# EAGLE design main_board (EAGLE 9.2.2)
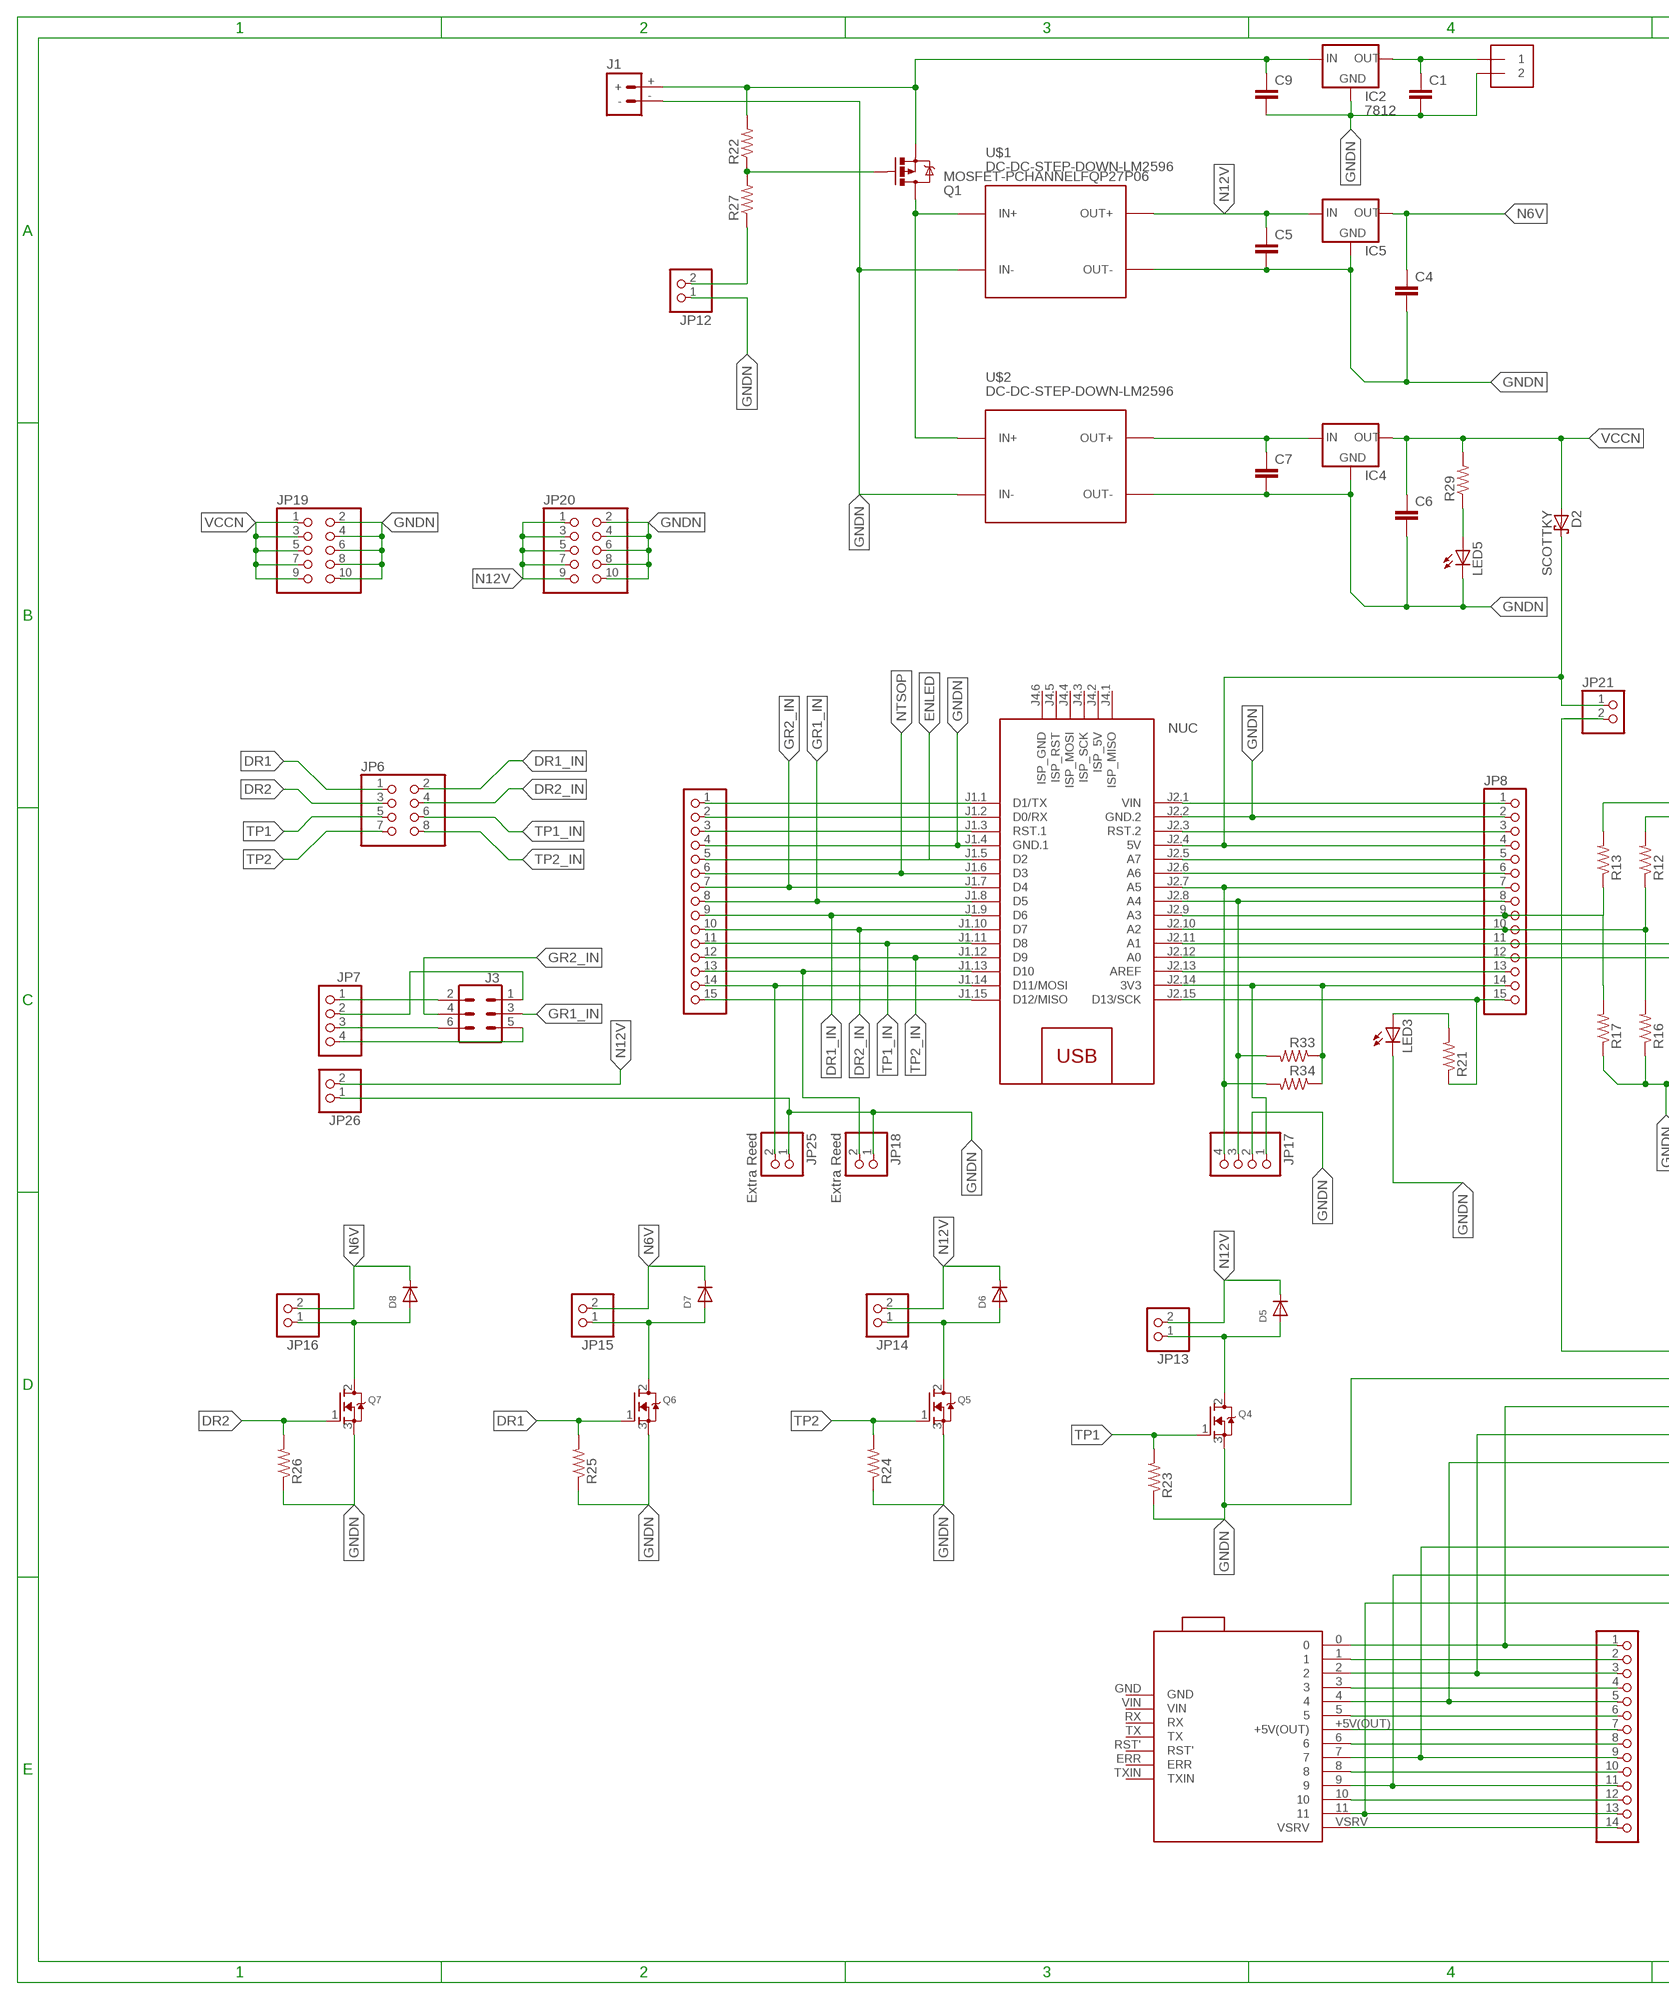
[diagram p0: schematic, sheet 1, part 1 of 2]
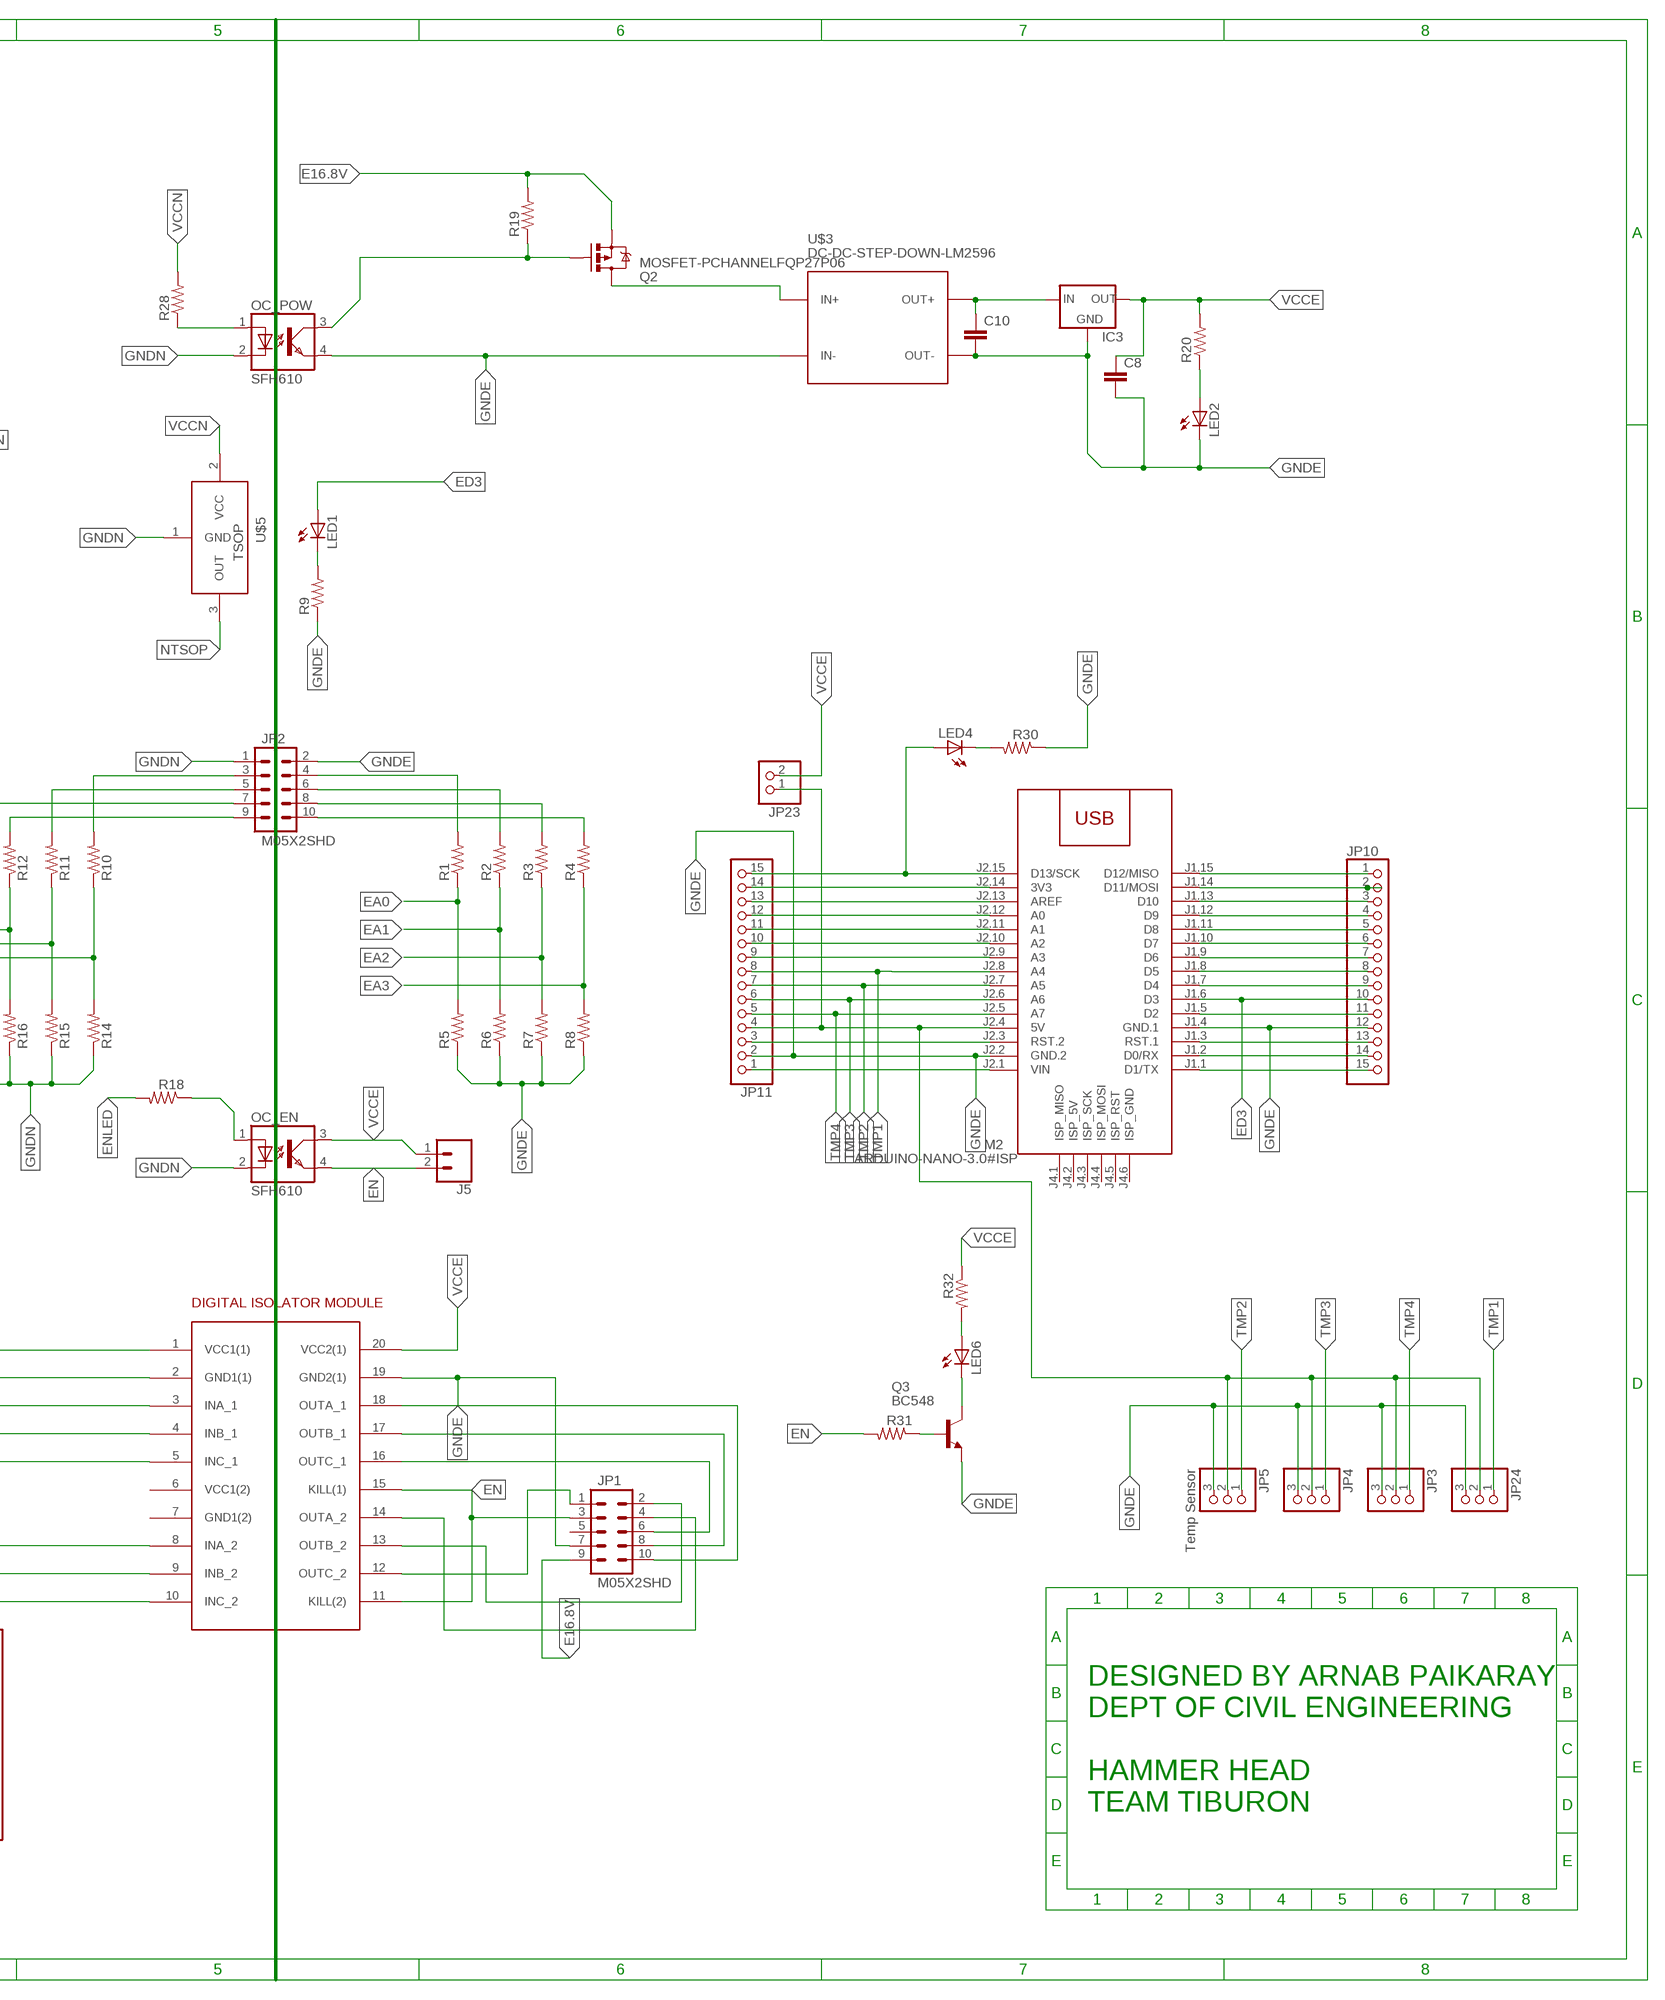
[diagram p1: schematic, sheet 1, part 2 of 2]

## Parts
C1  C-EU025-025X050  [C025-025X050]
C4  C-EU025-025X050  [C025-025X050]
C5  C-EU025-025X050  [C025-025X050]
C6  C-EU025-025X050  [C025-025X050]
C7  C-EU025-025X050  [C025-025X050]
C8  C-EU025-025X050  [C025-025X050]
C9  C-EU025-025X050  [C025-025X050]
C10  C-EU025-025X050  [C025-025X050]
D2  SCOTTKY  SCHOTTKY-DIODECB417-15  [CB417-15]
D5  DIODEDO-1N4148  [DO-1N4148]
D6  DIODEDO-1N4148  [DO-1N4148]
D7  DIODEDO-1N4148  [DO-1N4148]
D8  DIODEDO-1N4148  [DO-1N4148]
IC2  7812  78MXXS  [78MXXS]
IC3  78XXS  [78XXS]
IC4  78XXS  [78XXS]
IC5  78XXS  [78XXS]
J1  BATTERY_CONN_DEANS  [DEANS]
J3  CONN_03X2NO_SILK  [2X3-NS]
J5  CONN_02LOCK_LONGPADS  [1X02_LOCK_LONGPADS]
J6  1X2-3.5MM  [1X2-3.5MM]
JP1  M05X2SHD  [2X5-SHROUDED]
JP2  M05X2SHD  [2X5-SHROUDED]
JP3  PINHD-1X3  [1X03]
JP4  PINHD-1X3  [1X03]
JP5  Temp Sensor  PINHD-1X3  [1X03]
JP6  PINHD-2X4  [2X04]
JP7  PINHD-1X4  [1X04]
JP8  PINHD-1X15  [1X15]
JP9  PINHD-1X15  [1X15]
JP10  PINHD-1X15  [1X15]
JP11  PINHD-1X15  [1X15]
JP12  PINHD-1X2  [1X02]
JP13  PINHD-1X2  [1X02]
JP14  PINHD-1X2  [1X02]
JP15  PINHD-1X2  [1X02]
JP16  PINHD-1X2  [1X02]
JP17  PINHD-1X4  [1X04]
JP18  Extra Reed  PINHD-1X2  [1X02]
JP19  PINHD-2X5  [2X05]
JP20  PINHD-2X5  [2X05]
JP21  PINHD-1X2  [1X02]
JP22  PINHD-1X14  [1X14]
JP23  PINHD-1X2  [1X02]
JP24  PINHD-1X3  [1X03]
JP25  Extra Reed  PINHD-1X2  [1X02]
JP26  Extra Reed  PINHD-1X2  [1X02]
LED1  LED3MM  [LED3MM]
LED2  LED3MM  [LED3MM]
LED3  LED3MM  [LED3MM]
LED4  LED3MM  [LED3MM]
LED5  LED3MM  [LED3MM]
LED6  LED3MM  [LED3MM]
M2  ARDUINO-NANO-3.0#ISP  [ARDUINO-NANO-3.0#ISP]
NUC  ARDUINO-NANO-3.0#ISP  [ARDUINO-NANO-3.0#ISP]
OC_EN  SFH610  [DIL04]
OC_POW  SFH610  [DIL04]
Q1  MOSFET-PCHANNELFQP27P06  [TO220V]
Q2  MOSFET-PCHANNELFQP27P06  [TO220V]
Q3  BC548  [TO92-EBC]
Q4  MOSFET-NGDS_TO220V  [TO220V]
Q5  MOSFET-NGDS_TO220V  [TO220V]
Q6  MOSFET-NGDS_TO220V  [TO220V]
Q7  MOSFET-NGDS_TO220V  [TO220V]
R1  R-US_0204/7  [0204/7]
R2  R-US_0204/7  [0204/7]
R3  R-US_0204/7  [0204/7]
R4  R-US_0204/7  [0204/7]
R5  R-US_0204/7  [0204/7]
R6  R-US_0204/7  [0204/7]
R7  R-US_0204/7  [0204/7]
R8  R-US_0204/7  [0204/7]
R9  R-US_0204/7  [0204/7]
R10  R-US_0204/7  [0204/7]
R11  R-US_0204/7  [0204/7]
R12  R-US_0204/7  [0204/7]
R13  R-US_0204/7  [0204/7]
R14  R-US_0204/7  [0204/7]
R15  R-US_0204/7  [0204/7]
R16  R-US_0204/7  [0204/7]
R17  R-US_0204/7  [0204/7]
R18  R-US_0204/7  [0204/7]
R19  R-US_0204/7  [0204/7]
R20  R-US_0204/7  [0204/7]
R21  R-US_0204/7  [0204/7]
R22  R-US_0204/7  [0204/7]
R23  R-US_0204/7  [0204/7]
R24  R-US_0204/7  [0204/7]
R25  R-US_0204/7  [0204/7]
R26  R-US_0204/7  [0204/7]
R27  R-US_0204/7  [0204/7]
R28  R-US_0204/7  [0204/7]
R29  R-US_0204/7  [0204/7]
R30  R-US_0204/7  [0204/7]
R31  R-US_0204/7  [0204/7]
R32  R-US_0204/7  [0204/7]
R33  R-US_0204/7  [0204/7]
R34  R-US_0204/7  [0204/7]
U$1  DC-DC-STEP-DOWN-LM2596  [DC-DC-STEP-DOWN-LM2596]
U$2  DC-DC-STEP-DOWN-LM2596  [DC-DC-STEP-DOWN-LM2596]
U$3  DC-DC-STEP-DOWN-LM2596  [DC-DC-STEP-DOWN-LM2596]
U$5  TSOP34X  [TSOP3XXX]
U$6  SERVO_CONTROLLER  [SERVO_CONTROLLER]
U$7  DIGITAL_ISOLATOR  [DIGITAL_ISOLATOR_MODULE]

## Nets
DR1: JP6.1 Q6.1(G) R25.2
DR1_IN: JP6.2 JP9.9 NUC.J1.9(D6)
DR2: JP6.3 Q7.1(G) R26.2
DR2_IN: JP6.4 JP9.10 NUC.J1.10(D7)
E16.8V: JP1.9 Q2.3(S) R19.2
EA0: JP11.12 M2.J2.12(A0) R1.1 R5.2
EA1: JP11.11 M2.J2.11(A1) R2.1 R6.2
EA2: JP11.10 M2.J2.10(A2) R3.1 R7.2
EA3: JP11.9 M2.J2.9(A3) R4.1 R8.2
ED3: JP10.10 LED1.A M2.J1.6(D3)
EN: J5.2 JP1.3 OC_EN.4(EMIT) R31.2 U$7.11(KILL(2)) U$7.15(KILL(1))
ENLED: JP9.5 NUC.J1.5(D2) R18.2
GNDE: C8.2 C10.2 IC3.GND JP1.7 JP2.2 JP3.3 JP4.3 JP5.3 JP10.12 JP11.2 JP24.3 LED2.K(C) M2.J1.4(GND.1) M2.J2.2(GND.2) OC_POW.4(EMIT) Q3.E R5.1 R6.1 R7.1 R8.1 R9.1 R30.1 U$3.IN- U$3.OUT- U$7.19(GND2(1))
GNDN: C1.2 C4.2 C5.2 C6.2 C7.2 C9.2 IC2.GND IC4.GND IC5.GND J1.- J6.2 JP2.1 JP8.2 JP9.4 JP12.1 JP17.2 JP18.1 JP19.2 JP19.4 JP19.6 JP19.8 JP19.10 JP20.2 JP20.4 JP20.6 JP20.8 JP20.10 JP25.1 JP26.1 LED3.K(C) LED5.K(C) NUC.J1.4(GND.1) NUC.J2.2(GND.2) OC_EN.2(C) OC_POW.2(C) Q4.3(S) Q5.3(S) Q6.3(S) Q7.3(S) R14.1 R15.1 R16.1 R17.1 R23.1 R24.1 R25.1 R26.1 U$1.IN- U$1.OUT- U$2.IN- U$2.OUT- U$5.1(GND) U$7.2(GND1(1))
GR1_IN: J3.3 JP9.8 NUC.J1.8(D5)
GR2_IN: J3.4 JP9.7 NUC.J1.7(D4)
N6V: C4.1 D7.C D8.C IC5.OUT JP15.2 JP16.2
N12V: C5.1 D5.C D6.C IC5.IN JP13.2 JP14.2 JP20.1 JP20.3 JP20.5 JP20.7 JP20.9 JP26.2 U$1.OUT+
N$1: JP10.11 M2.J1.5(D2)
N$2: OC_EN.1(A) R18.1
N$4: JP9.1 NUC.J1.1(D1/TX)
N$5: JP9.2 NUC.J1.2(D0/RX)
N$6: JP9.3 NUC.J1.3(RST.1)
N$7: LED1.K(C) R9.2
N$8: JP2.4 R1.2
N$9: JP2.6 R2.2
N$10: JP2.8 R3.2
N$11: JP2.10 R4.2
N$12: JP8.7 JP17.4 NUC.J2.7(A5) R34.2
N$13: JP8.8 JP17.3 NUC.J2.8(A4) R33.2
N$14: LED3.A R21.2
N$15: JP2.3 R10.2
N$16: JP2.5 R11.2
N$17: LED4.K(C) R30.2
N$18: JP2.9 R12.2
N$19: JP2.7 R13.2
N$20: JP22.12 U$6.10
N$21: OC_POW.3(COL) Q2.1(G) R19.1
N$22: JP22.10 U$6.8
N$23: C10.1 IC3.IN U$3.OUT+
N$24: JP22.3 U$6.2 U$7.4(INB_1)
N$25: Q2.2(D) U$3.IN+
N$26: LED2.A R20.1
N$27: JP8.14 JP17.1 NUC.J2.14(3V3) R33.1 R34.1
N$28: D2.C JP8.4 JP21.1 NUC.J2.4(5V)
N$29: JP3.2 JP4.2 JP5.2 JP11.4 JP23.1 JP24.2 M2.J2.4(5V)
N$30: JP8.10 NUC.J2.10(A2) R12.1 R16.2
N$31: Q3.B R31.1
N$32: JP22.8 U$6.6
N$33: JP1.1 U$7.12(OUTC_2)
N$34: JP1.2 U$7.13(OUTB_2)
N$35: JP22.13 U$6.11 U$7.10(INC_2)
N$36: C9.1 IC2.IN J1.+ Q1.3(S) R22.2
N$37: C1.1 IC2.OUT J6.1
N$38: JP22.2 U$6.1
N$39: JP1.4 U$7.14(OUTA_2)
N$40: JP1.6 U$7.16(OUTC_1)
N$41: JP1.8 U$7.17(OUTB_1)
N$42: JP11.1 M2.J2.1(VIN)
N$43: JP1.10 U$7.18(OUTA_1)
N$45: JP9.13 JP18.2 NUC.J1.13(D10)
N$46: JP9.14 JP25.2 NUC.J1.14(D11/MOSI)
N$47: JP8.13 NUC.J2.13(AREF)
N$48: JP9.15 NUC.J1.15(D12/MISO)
N$49: JP22.11 U$6.9 U$7.9(INB_2)
N$50: J3.6 JP7.3
N$51: J3.2 JP7.1
N$52: J3.1 JP7.2
N$53: J3.5 JP7.4
N$54: JP8.1 NUC.J2.1(VIN)
N$55: JP8.9 NUC.J2.9(A3) R13.1 R17.2
N$56: JP8.3 NUC.J2.3(RST.2)
N$57: JP21.2 U$7.1(VCC1(1))
N$60: JP22.4 U$6.3
N$61: JP22.9 U$6.7 U$7.8(INA_2)
N$64: JP8.15 NUC.J2.15(D13/SCK) R21.1
N$66: JP22.6 U$6.5
N$67: JP22.7 U$6.+5V(OUT)
N$68: JP22.5 U$6.4 U$7.5(INC_1)
N$70: Q1.1(G) R22.1 R27.2
N$73: JP22.1 U$6.0 U$7.3(INA_1)
N$75: JP10.1 M2.J1.15(D12/MISO)
N$76: JP10.2 M2.J1.14(D11/MOSI)
N$77: JP10.3 M2.J1.13(D10)
N$78: JP10.4 M2.J1.12(D9)
N$79: JP10.5 M2.J1.11(D8)
N$80: JP10.6 M2.J1.10(D7)
N$81: JP10.7 M2.J1.9(D6)
N$82: JP10.8 M2.J1.8(D5)
N$83: JP10.9 M2.J1.7(D4)
N$84: JP22.14 U$6.VSRV
N$86: JP10.13 M2.J1.3(RST.1)
N$87: JP10.14 M2.J1.2(D0/RX)
N$88: JP10.15 M2.J1.1(D1/TX)
N$89: JP11.15 LED4.A M2.J2.15(D13/SCK)
N$90: JP11.14 M2.J2.14(3V3)
N$91: JP11.13 M2.J2.13(AREF)
N$93: JP11.3 M2.J2.3(RST.2)
N$95: D5.A JP13.1 Q4.2(D)
N$96: D6.A JP14.1 Q5.2(D)
N$97: JP12.2 R27.1
N$98: D7.A JP15.1 Q6.2(D)
N$99: D8.A JP16.1 Q7.2(D)
N$100: C7.1 IC4.IN U$2.OUT+
N$101: OC_POW.1(A) R28.1
N$102: Q1.2(D) U$1.IN+ U$2.IN+
N$104: LED5.A R29.1
N$106: LED6.K(C) Q3.C
N$107: LED6.A R32.2
NA0: JP8.5 NUC.J2.5(A7)
NA1: JP8.6 NUC.J2.6(A6)
NA2: JP8.11 NUC.J2.11(A1) R11.1 R15.2
NA3: JP8.12 NUC.J2.12(A0) R10.1 R14.2
NTSOP: JP9.6 NUC.J1.6(D3) U$5.3(OUT)
TMP1: JP11.8 JP24.1 M2.J2.8(A4)
TMP2: JP5.1 JP11.7 M2.J2.7(A5)
TMP3: JP4.1 JP11.6 M2.J2.6(A6)
TMP4: JP3.1 JP11.5 M2.J2.5(A7)
TP1: JP6.5 Q4.1(G) R23.2
TP1_IN: JP6.6 JP9.11 NUC.J1.11(D8)
TP2: JP6.7 Q5.1(G) R24.2
TP2_IN: JP6.8 JP9.12 NUC.J1.12(D9)
VCCE: C8.1 IC3.OUT J5.1 JP23.2 OC_EN.3(COL) R20.2 R32.1 U$7.20(VCC2(1))
VCCN: C6.1 D2.A IC4.OUT JP19.1 JP19.3 JP19.5 JP19.7 JP19.9 R28.2 R29.2 U$5.2(VCC)
Unconnected: JP1.5 M2.J4.1(ISP_MISO) M2.J4.2(ISP_5V) M2.J4.3(ISP_SCK) M2.J4.4(ISP_MOSI) M2.J4.5(ISP_RST) M2.J4.6(ISP_GND) NUC.J4.1(ISP_MISO) NUC.J4.2(ISP_5V) NUC.J4.3(ISP_SCK) NUC.J4.4(ISP_MOSI) NUC.J4.5(ISP_RST) NUC.J4.6(ISP_GND) U$6.ERR U$6.GND U$6.RST' U$6.RX U$6.TX U$6.TXIN U$6.VIN U$7.6(VCC1(2)) U$7.7(GND1(2))

## Notes on the sheet
- DESIGNED BY ARNAB PAIKARAY
  DEPT OF CIVIL ENGINEERING
  
  HAMMER HEAD
  TEAM TIBURON

## Library data of the parts
C1 C4-C10 = rcl:C-EU: CAPACITOR, European symbol; SPICEPREFIX: C
D2 = adafruit:SCHOTTKY-DIODE: Schottky Diode
D5-D8 = adafruit:DIODE: Diode SMADIODE - SMA Surface Mount Package 20V 1A Schottky Diode Digikey: 641-1014-6-ND DO-1N4148 - Through Hole Small Current Diode SOD-123 20V 1 A (.5mV Vf) Schottky Diode - Digikey: MBRX120TPMSCT-ND SOD-323 10V 570mA (.38mV Vf, 3ns) Schottky Diode - Digikey: ZLLS410CT-ND SOD-523 30V 30mA Schottky Diode (RB751S-40TE61) - Digikey: RB751S-40TE61CT-ND SOT23-R/W - SOT23 Package (R = Solder Paste/Reflow Ovens, W = Hand-Soldering) BAT54Film 40V 300mA - Digikey: 497-7162-1-ND
IC2 = v-reg:78MXXS: VOLTAGE REGULATOR
IC3-IC5 = v-reg:78XXS: VOLTAGE REGULATOR
J1 = SparkFun-Connectors:BATTERY_CONN: Battery Connectors Various footprints for battery connections SparkFun Products: Deans Connector -M/F Pair <https://www.sparkfun.com/products/11864>; SF_ID: PRT-11864
J3 = SparkFun-Connectors:CONN_03X2: Multi connection point. Often used as Generic Header-pin footprint for 0.1 inch spaced/style header connections You can populate with any combo of single row headers, but if you'd like an exact match, check these: Header - 2x3 (Male, 0.1") <https://www.sparkfun.com/products/12807> (PRT-12807) Header - 2x3 (Female, 0.1") <https://www.sparkfun.com/products/13010> (PRT-13010) 2x3 Pin Shrouded Header <https://www.sparkfun.com/products/10877> (PRT-10877) On any of the 0.1 inch spaced packages, you can populate with these: Break Away Headers - Straight <https://www.sparkfun.com/products/116> (PRT-00116) Break Away Male Headers - Right Angle <https://www.sparkfun.com/products/553> (PRT-00553) Female Headers <https://www.sparkfun.com/products/115> (PRT-00115) Break Away Headers - Machine Pin <https://www.sparkfun.com/products/117> (PRT-00117) Break Away Female Headers - Swiss Machine Pin <https://www.sparkfun.com/products/743> (PRT-00743) Special note: the shrouded connector mates well with our 3x2 ribbon cables: Ribbon Crimp Connector - 6-pin (2x3, Female) <https://www.sparkfun.com/products/10651> (PRT-10651) Ribbon Cable - 6 wire (15ft) <https://www.sparkfun.com/products/10646> (PRT-10646)
J5 = SparkFun-Connectors:CONN_02: Multi connection point. Often used as Generic Header-pin footprint for 0.1 inch spaced/style header connections On any of the 0.1 inch spaced packages, you can populate with these: Break Away Headers - Straight <https://www.sparkfun.com/products/116> (PRT-00116) Break Away Male Headers - Right Angle <https://www.sparkfun.com/products/553> (PRT-00553) Female Headers <https://www.sparkfun.com/products/115> (PRT-00115) Break Away Headers - Machine Pin <https://www.sparkfun.com/products/117> (PRT-00117) Break Away Female Headers - Swiss Machine Pin <https://www.sparkfun.com/products/743> (PRT-00743) For SCREWTERMINALS and SPRING TERMINALS visit here: Screw Terimnals on SparkFun.com <https://www.sparkfun.com/search/results?term=Screw+Terminals> (5mm/3.5mm/2.54mm spacing) This device is also useful as a general connection point to wire up your design to another part of your project. Our various solder wires solder well into these plated through hole pads. Hook-Up Wire - Assortment (Stranded, 22 AWG) <https://www.sparkfun.com/products/11375> (PRT-11375) Hook-Up Wire - Assortment (Solid Core, 22 AWG) <https://www.sparkfun.com/products/11367> (PRT-11367) View the entire wire category on our website here <https://www.sparkfun.com/categories/141> Special notes: Molex polarized connector foot print use with: PRT-08233 with associated crimp pins and housings. 2.54_SCREWTERM for use with PRT-10571. 3.5mm Screw Terminal footprints for PRT-08084 5mm Screw Terminal footprints for use with PRT-08432
J6 = adafruit:1X2: 3.5mm Terminal block http://www.ladyada.net/library/pcb/eaglelibrary.html
JP1 JP2 = SparkFun-Connectors:M05X2: Header 5x2 Standard 10-pin dual row 0.1" header. Commonly used with AVR-ISP. Use with Spark Fun Electronics SKU: PRT-00778
JP3-JP5 JP24 = adafruit:PINHD-1X3: PIN HEADER
JP6 = adafruit:PINHD-2X4: PIN HEADER
JP7 JP17 = pinhead:PINHD-1X4: PIN HEADER
JP8-JP11 = adafruit:PINHD-1X15: PIN HEADER
JP12-JP16 JP18 JP21 JP23 JP25 JP26 = pinhead:PINHD-1X2: PIN HEADER
JP19 JP20 = pinhead:PINHD-2X5: PIN HEADER
JP22 = pinhead:PINHD-1X14: PIN HEADER
LED1-LED6 = CEDT_JANUARY_2015_v5:LED
M2 NUC = diy-modules:ARDUINO-NANO-3.0#ISP: Arduino Nano 3.0 (and compatible devices) with ISP pads More details available here: https://www.arduino.cc/en/Main/ArduinoBoardNano Click here to find device on ebay.com <http://www.ebay.com/sch/arduino+nano>
OC_EN OC_POW = optocoupler:SFH610: SIEMENS OPTO COUPLER; MF: VISHAY/TELEFUNKEN; MPN: SFH6106-4; OC_FARNELL: 1469568; OC_NEWARK: 58K2193
Q1 Q2 = SparkFun-DiscreteSemi:MOSFET-PCHANNEL: Generic PMOSFET IRLML2244 - TRANS-11153 (SOT-23 -20V -4.3A) (1.Gate 2.Source 3.Drain) FQP27P06 - COM-10349 <http://www.sparkfun.com/products/10349> (TO-220 -60V -27A) (1.Gate 2.Source 3.Drain)
Q3 = transistor-npn:BC548*: NPN Transistor
Q4-Q7 = adafruit:MOSFET-N: N-Channel Mosfet 2N7002E - 60V 260mA SOT23 [Digikey: 2N7002ET1GOSTR-ND] - REEL BSH103 - 30V 850mA SOT23 [Digikey: 568-5013-1-ND]
R1-R34 = rcl:R-US_: RESISTOR, American symbol; SPICEPREFIX: R
U$1-U$3 = diy-modules:DC-DC-STEP-DOWN-LM2596: DC/DC Step-Down Regulator based on LM2596-ADJ chip LM2596 datasheet available here: http://www.ti.com/lit/ds/symlink/lm2596.pdf Click here to find device on ebay.com <http://www.ebay.com/sch/lm2596+power+regulator>
U$5 = CEDT_JANUARY_2015_v5:TSOP34X: Vishay IR Reciever Product Page <http://www.vishay.com/product?docid=82489> Family -TSOP34XX Part by : Rohit Gupta
U$6 = Servo Controller:SERVO_CONTROLLER
U$7 = ISO7330C DIGITAL ISOLATOR MODULE:DIGITAL_ISOLATOR

## Board
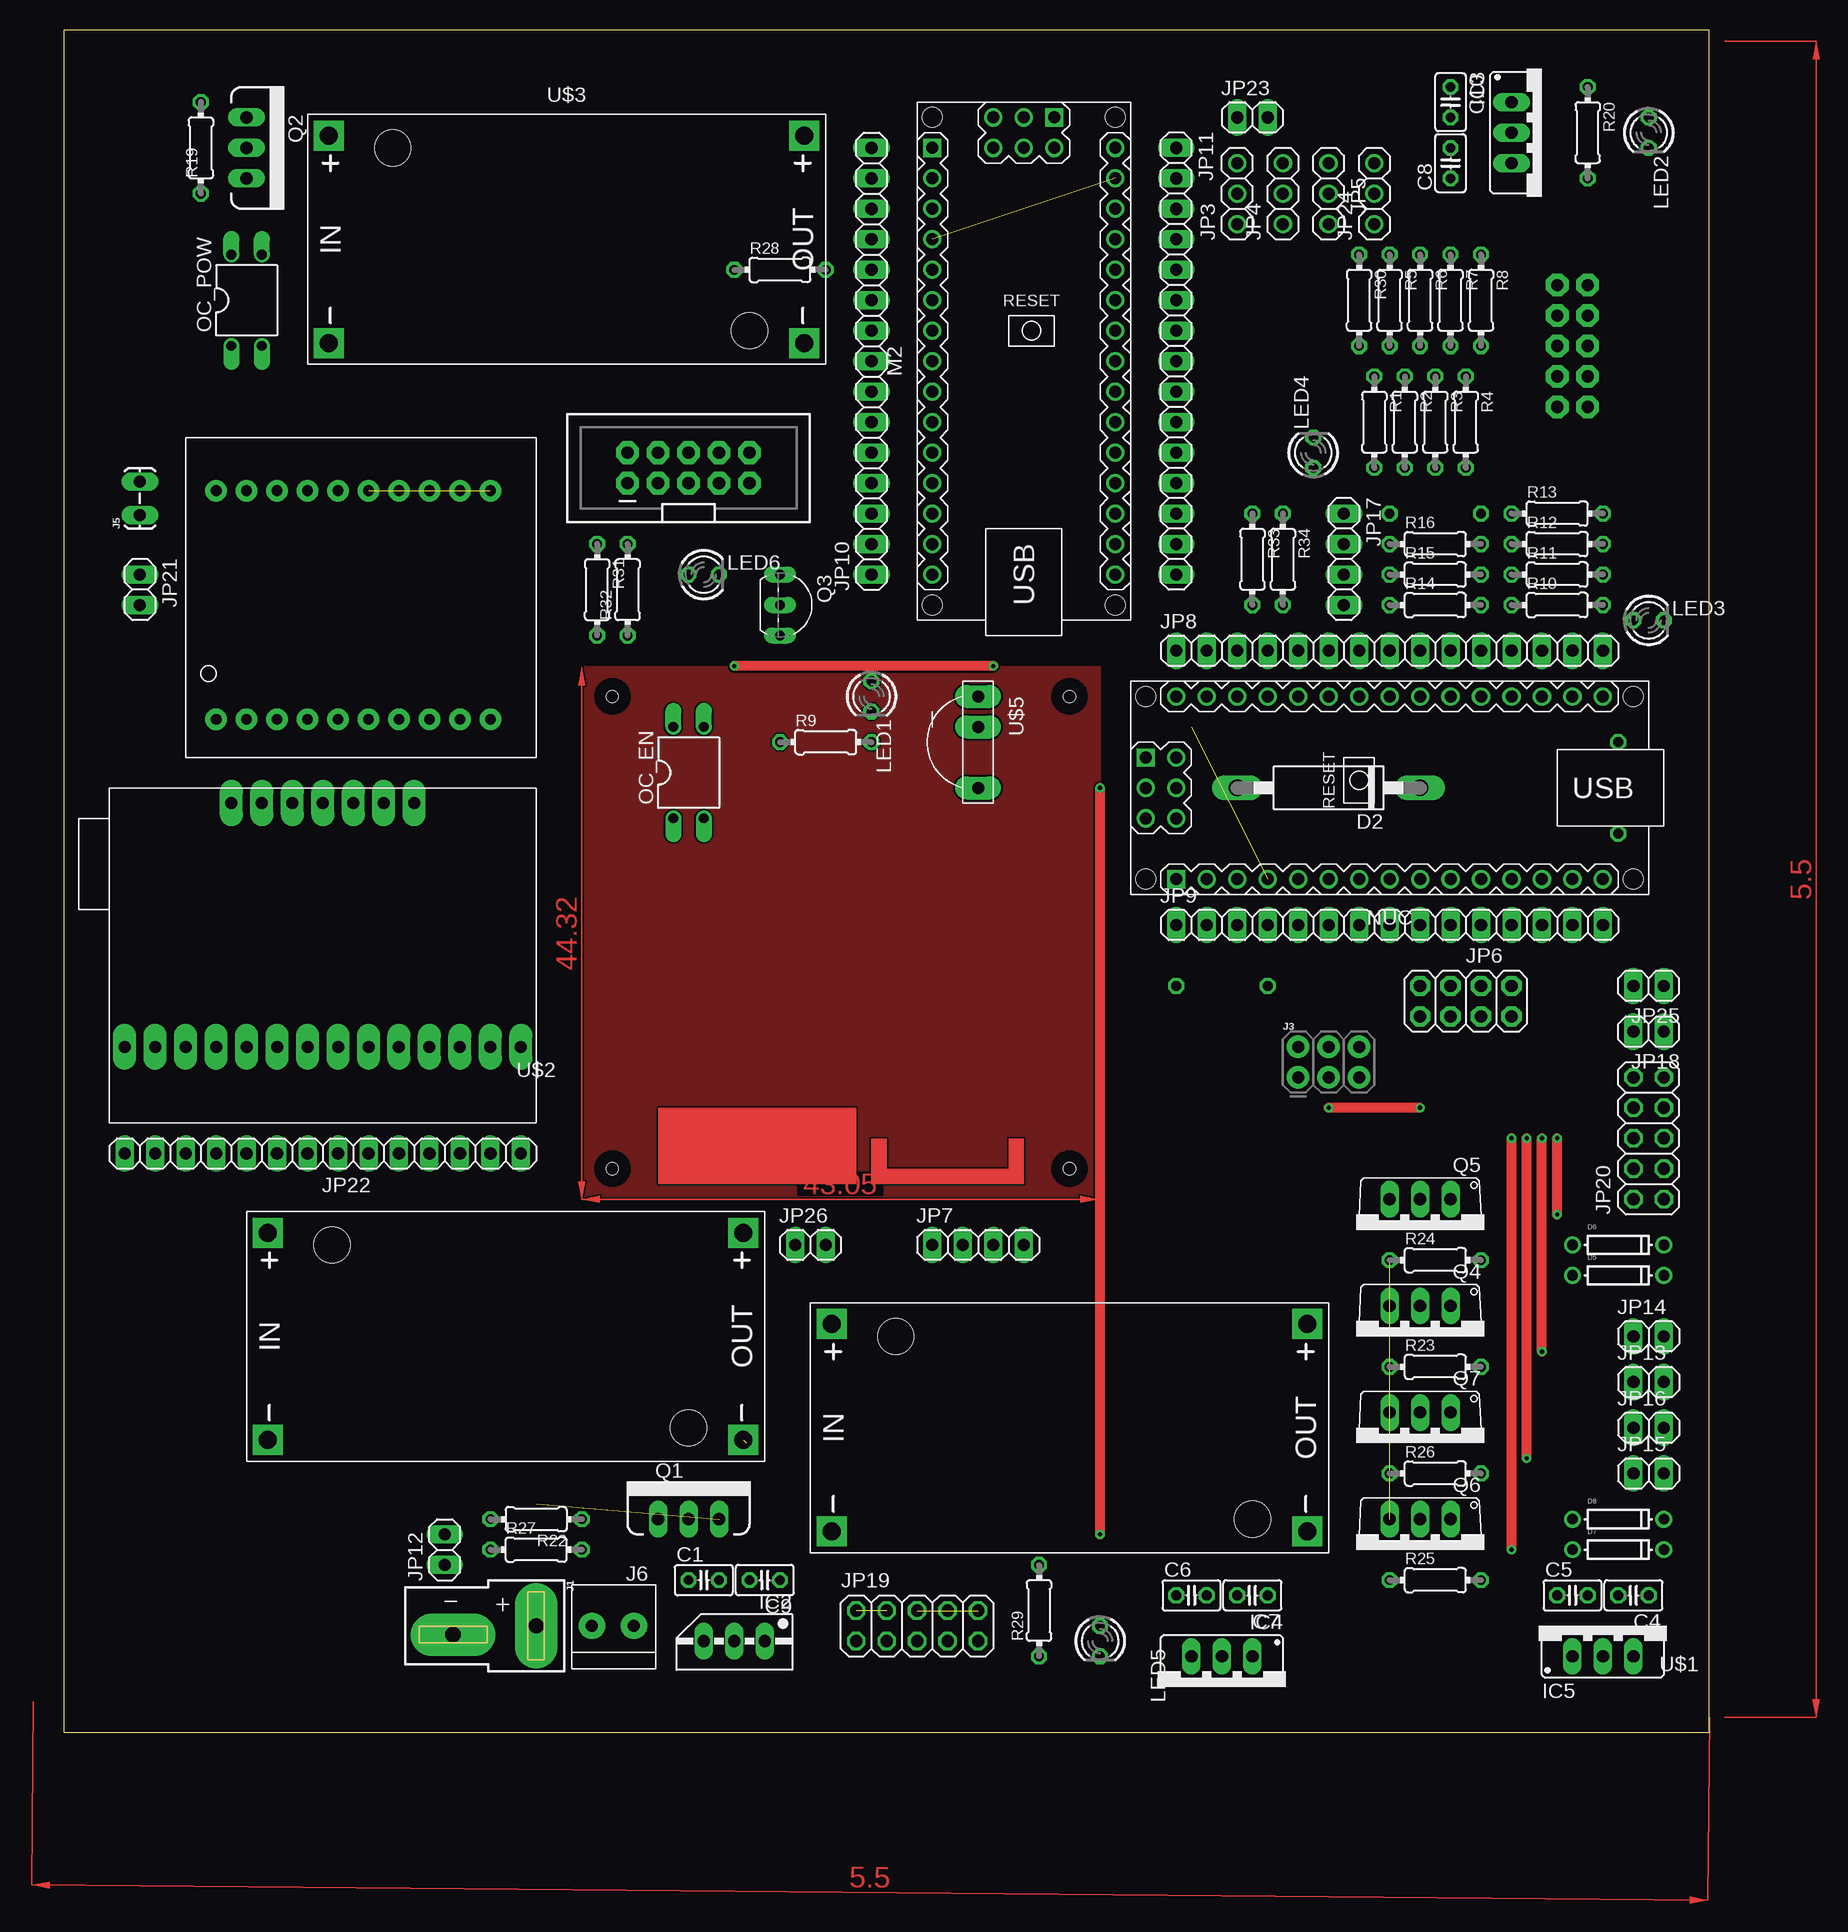
[diagram p2: board, top side]
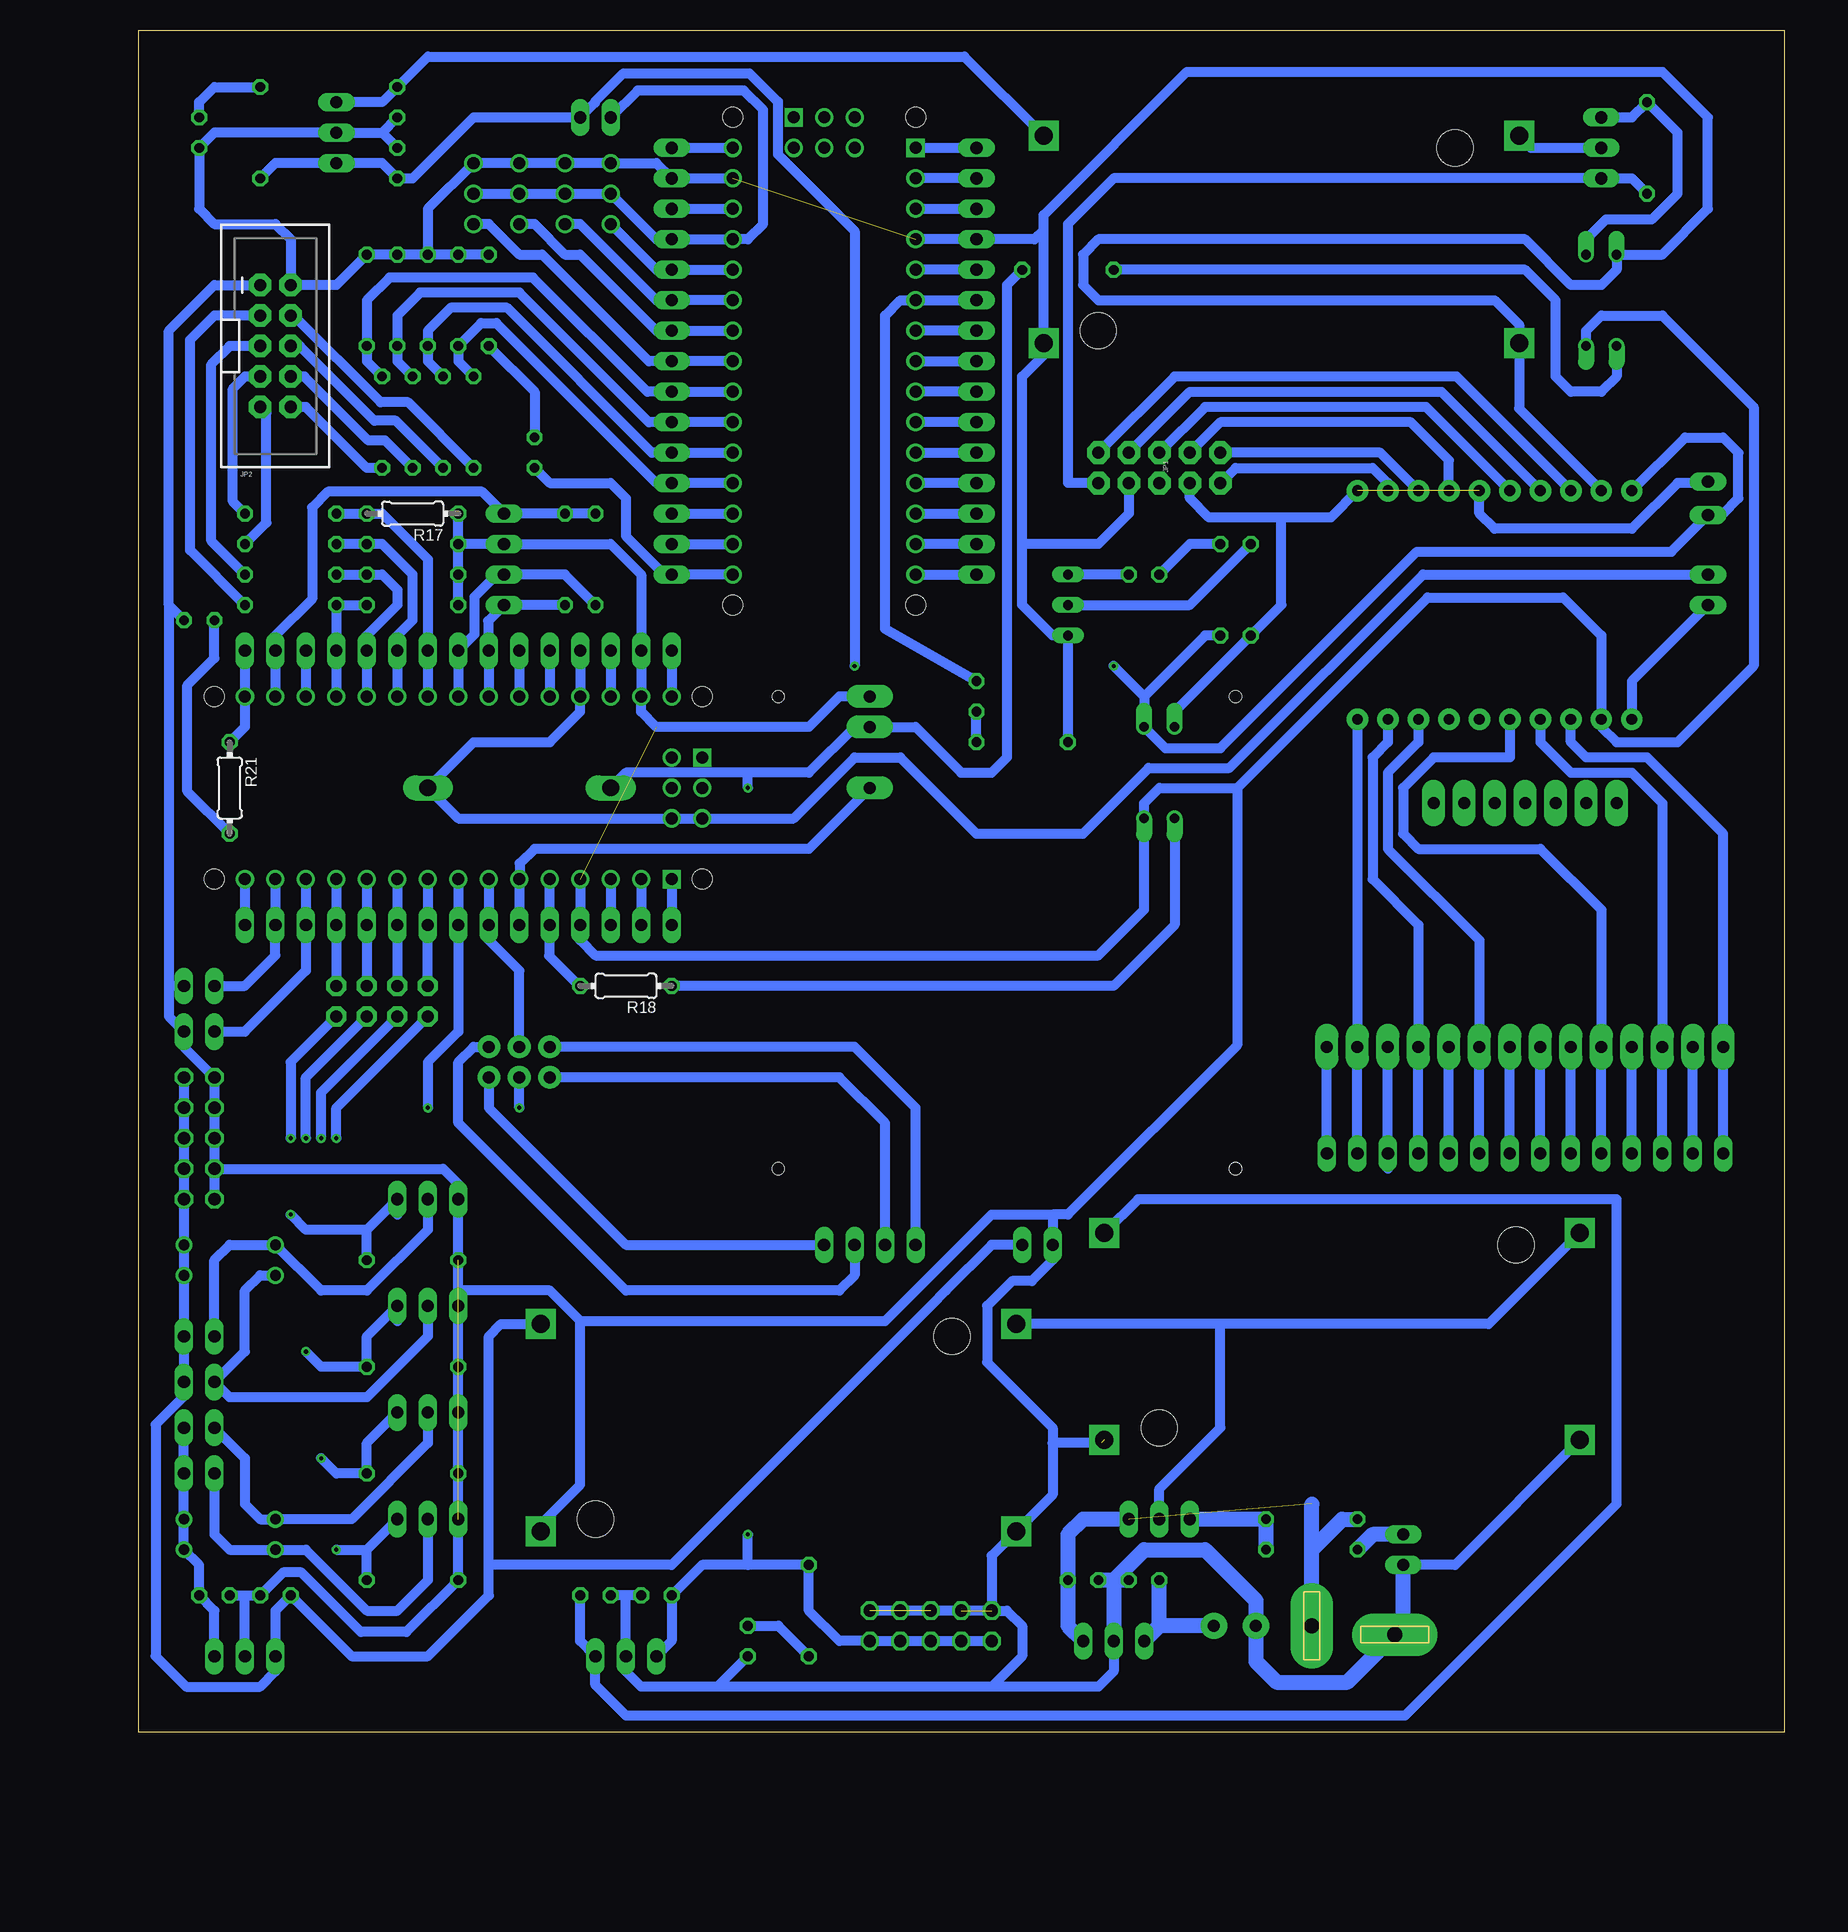
[diagram p3: board, bottom side, seen from below]

Size 137.14 x 141.91 mm. Coordinates in mm from the lower left corner, seen from the top.
Outline: 0,0 137.14,0 137.14,141.91 0,141.91 0,0
Copper layers (1*16): Top 0.035mm / dielectric 1.5mm / Bottom 0.035mm
Design rules "default": minimum track width 6mil, minimum drill 0.35mm, track to track 6mil, track to pad 6mil, pad to pad 6mil, via to via 6mil, smd to smd 6mil, copper to edge 40mil, drill to drill 6mil, minimum pad ring 10mil, minimum via ring 8mil, stop-mask expansion 4mil, vias tented up to drill 0mil, thermal gap 10mil
Holes 1 mm at 45.72,86.36 83.82,86.36 83.82,46.99 45.72,46.99

### Footprints (pad centres in the part's own frame; a part is rotated, then mirrored left to right if it is on the bottom)
C025-025X050 = drill 0.813 octagon: 1 -1.27,0; 2 1.27,0
CB417-15 = drill 1.397 long: A 7.62,0; C -7.62,0
DO-1N4148 = drill 0.9: A -3.81,0; C 3.81,0
78MXXS = drill 1.016 long: GND 0,-2.54; IN -2.54,-2.54; OUT 2.54,-2.54
78XXS = drill 1.016 long: GND 0,-2.54; IN -2.54,-2.54; OUT 2.54,-2.54
DEANS = drill 1.27 pad 3.556 long: + 0,0; - 0.737,-6.921
2X3-NS = drill 1.016 pad 1.88: 1 -2.54,-1.27; 2 -2.54,1.27; 3 0,-1.27; 4 0,1.27; 5 2.54,-1.27; 6 2.54,1.27
1X02_LOCK_LONGPADS = drill 1.016 long: 1 -0.127,0; 2 2.667,0
1X2-3.5MM = drill 1 pad 2.184: 1 1.8,0; 2 -1.7,0
2X5-SHROUDED = drill 1.016 pad 1.88 octagon: 1 -1.27,5.08; 2 1.27,5.08; 3 -1.27,2.54; 4 1.27,2.54; 5 -1.27,0; 6 1.27,0; 7 -1.27,-2.54; 8 1.27,-2.54; 9 -1.27,-5.08; 10 1.27,-5.08
1X03 = drill 1.016: 1 -2.54,0; 2 0,0; 3 2.54,0
2X04 = drill 1.016 pad 1.676 octagon: 1 -3.81,-1.27; 2 -3.81,1.27; 3 -1.27,-1.27; 4 -1.27,1.27; 5 1.27,-1.27; 6 1.27,1.27; 7 3.81,-1.27; 8 3.81,1.27
1X04 = drill 1.016 long: 1 -3.81,0; 2 -1.27,0; 3 1.27,0; 4 3.81,0
1X15 = drill 1.016 long: 1 -17.78,0; 2 -15.24,0; 3 -12.7,0; 4 -10.16,0; 5 -7.62,0; 6 -5.08,0; 7 -2.54,0; 8 0,0; 9 2.54,0; 10 5.08,0; 11 7.62,0; 12 10.16,0; 13 12.7,0; 14 15.24,0; 15 17.78,0
1X02 = drill 1.016 long: 1 -1.27,0; 2 1.27,0
2X05 = drill 1.016 octagon: 1 -5.08,-1.27; 2 -5.08,1.27; 3 -2.54,-1.27; 4 -2.54,1.27; 5 0,-1.27; 6 0,1.27; 7 2.54,-1.27; 8 2.54,1.27; 9 5.08,-1.27; 10 5.08,1.27
1X14 = drill 1.016 long: 1 -16.51,0; 2 -13.97,0; 3 -11.43,0; 4 -8.89,0; 5 -6.35,0; 6 -3.81,0; 7 -1.27,0; 8 1.27,0; 9 3.81,0; 10 6.35,0; 11 8.89,0; 12 11.43,0; 13 13.97,0; 14 16.51,0
LED3MM = drill 0.813 octagon: A -1.27,0; K 1.27,0
ARDUINO-NANO-3.0#ISP = drill 1 square: J1.1 17.78,7.62; J4.1 20.32,-2.54 | drill 1: J1.2 15.24,7.62; J1.3 12.7,7.62; J1.4 10.16,7.62; J1.5 7.62,7.62; J1.6 5.08,7.62; J1.7 2.54,7.62; J1.8 0,7.62; J1.9 -2.54,7.62; J1.10 -5.08,7.62; J1.11 -7.62,7.62; J1.12 -10.16,7.62; J1.13 -12.7,7.62; J1.14 -15.24,7.62; J1.15 -17.78,7.62; J2.1 17.78,-7.62; J2.2 15.24,-7.62; J2.3 12.7,-7.62; J2.4 10.16,-7.62; J2.5 7.62,-7.62; J2.6 5.08,-7.62; J2.7 2.54,-7.62; J2.8 0,-7.62; J2.9 -2.54,-7.62; J2.10 -5.08,-7.62; J2.11 -7.62,-7.62; J2.12 -10.16,-7.62; J2.13 -12.7,-7.62; J2.14 -15.24,-7.62; J2.15 -17.78,-7.62; J4.2 17.78,-2.54; J4.3 20.32,0; J4.4 17.78,0; J4.5 20.32,2.54; J4.6 17.78,2.54 | hole 1.651: -20.32,7.62; -20.32,-7.62; 20.32,-7.62; 20.32,7.62
DIL04 = drill 0.813 offset: 1 -1.27,-3.81; 2 1.27,-3.81; 3 1.27,3.81; 4 -1.27,3.81
TO220V = drill 1.016 long: 1 -2.54,0; 2 0,0; 3 2.54,0
TO92-EBC = drill 0.813 long: B 0,-1.27; C -2.54,-1.27; E 2.54,-1.27
TO220V' = drill 1.016 long: 1 -2.54,-2.54; 2 0,-2.54; 3 2.54,-2.54
0204/7 = drill 0.813 octagon: 1 -3.81,0; 2 3.81,0
DC-DC-STEP-DOWN-LM2596 = drill 1.5 pad 2.5 square: IN+ -19.812,8.636; IN- -19.812,-8.636; OUT+ 19.812,8.636; OUT- 19.812,-8.636 | hole 3: -14.478,7.62; 15.24,-7.62
TSOP3XXX = drill 1 pad 1.93 long: 1 -2.54,0; 2 0,0; 3 5.08,0
SERVO_CONTROLLER = drill 1 pad 1.93 long: 0 6.35,34.29; 1 6.35,31.75; 2 6.35,29.21; 3 6.35,26.67; 4 6.35,24.13; 5 6.35,21.59; 6 6.35,16.51; 7 6.35,13.97; 8 6.35,11.43; 9 6.35,8.89; 10 6.35,6.35; 11 6.35,3.81; +5V(OUT) 6.35,19.05; ERR 26.67,12.7; GND 26.67,25.4; RST' 26.67,15.24; RX 26.67,20.32; TX 26.67,17.78; TXIN 26.67,10.16; VIN 26.67,22.86; VSRV 6.35,1.27
DIGITAL_ISOLATOR_MODULE = drill 0.9 pad 1.778: 1 3.175,26.67; 2 3.175,24.13; 3 3.175,21.59; 4 3.175,19.05; 5 3.175,16.51; 6 3.175,13.97; 7 3.175,11.43; 8 3.175,8.89; 9 3.175,6.35; 10 3.175,3.81; 11 22.225,3.81; 12 22.225,6.35; 13 22.225,8.89; 14 22.225,11.43; 15 22.225,13.97; 16 22.225,16.51; 17 22.225,19.05; 18 22.225,21.59; 19 22.225,24.13; 20 22.225,26.67

### Placement (x,y rotation side)
C1  53.34,12.7 0 top
C4  130.81,11.43 180 top
C5  125.73,11.43 0 top
C6  93.98,11.43 0 top
C7  99.06,11.43 180 top
C8  115.57,130.81 90 top
C9  58.42,12.7 180 top
C10  115.57,135.89 270 top
D2  105.41,78.74 180 top
D5  129.54,38.1 0 top
D6  129.54,40.64 0 top
D7  129.54,15.24 0 top
D8  129.54,17.78 0 top
IC2  55.88,5.08 180 top
IC3  123.19,133.35 270 top
IC4  96.52,3.81 180 top
IC5  128.27,8.89 0 top
J1  39.37,8.89 270 top
J3  105.41,55.88 0 top
J5  6.35,101.6 90 top
J6  45.72,8.89 0 top
JP1  52.07,105.41 90 top
JP2  125.73,115.57 0 bottom
JP3  97.79,128.27 90 top
JP4  101.6,128.27 90 top
JP5  105.41,128.27 90 top
JP6  116.84,60.96 0 top
JP7  76.2,40.64 0 top
JP8  110.49,90.17 0 top
JP9  110.49,67.31 0 top
JP10  67.31,114.3 90 top
JP11  92.71,114.3 270 top
JP12  31.75,15.24 90 top
JP13  132.08,29.21 0 top
JP14  132.08,33.02 0 top
JP15  132.08,21.59 0 top
JP16  132.08,25.4 0 top
JP17  106.68,97.79 270 top
JP18  132.08,58.42 180 top
JP19  71.12,8.89 0 top
JP20  132.08,49.53 90 top
JP21  6.35,95.25 270 top
JP22  21.59,48.26 0 top
JP23  99.06,134.62 0 top
JP24  109.22,128.27 90 top
JP25  132.08,62.23 180 top
JP26  62.23,40.64 0 top
LED1  67.31,86.36 270 top
LED2  132.08,133.35 270 top
LED3  132.08,92.71 0 top
LED4  104.14,106.68 90 top
LED5  86.36,7.62 270 top
LED6  53.34,96.52 0 top
M2  80.01,114.3 90 top
NUC  110.49,78.74 180 top
OC_EN  52.07,80.01 0 top
OC_POW  15.24,119.38 0 top
Q1  52.07,17.78 0 top
Q2  15.24,132.08 270 top
Q3  60.96,93.98 270 top
Q4  [TO220V']  113.03,33.02 180 top
Q5  [TO220V']  113.03,41.91 180 top
Q6  [TO220V']  113.03,15.24 180 top
Q7  [TO220V']  113.03,24.13 180 top
R1  109.22,109.22 270 top
R2  111.76,109.22 270 top
R3  114.3,109.22 270 top
R4  116.84,109.22 270 top
R5  110.49,119.38 270 top
R6  113.03,119.38 270 top
R7  115.57,119.38 270 top
R8  118.11,119.38 270 top
R9  63.5,82.55 0 top
R10  124.46,93.98 0 top
R11  124.46,96.52 0 top
R12  124.46,99.06 0 top
R13  124.46,101.6 0 top
R14  114.3,93.98 0 top
R15  114.3,96.52 0 top
R16  114.3,99.06 0 top
R17  114.3,101.6 180 bottom
R18  96.52,62.23 180 bottom
R19  11.43,132.08 270 top
R20  127,133.35 270 top
R21  129.54,78.74 270 bottom
R22  39.37,17.78 180 top
R23  114.3,30.48 0 top
R24  114.3,39.37 0 top
R25  114.3,12.7 0 top
R26  114.3,21.59 0 top
R27  39.37,15.24 0 top
R28  59.69,121.92 0 top
R29  81.28,10.16 90 top
R30  107.95,119.38 270 top
R31  44.45,95.25 270 top
R32  46.99,95.25 90 top
R33  99.06,97.79 270 top
R34  101.6,97.79 270 top
U$1  83.82,25.4 0 top
U$2  36.83,33.02 0 top
U$3  41.91,124.46 0 top
U$5  76.2,83.82 270 top
U$6  39.37,50.8 90 top
U$7  39.37,81.28 90 top

### Tracks (layer width: path | path; a pad name or v marks a point on that pad's centre or on a via)
DR1  (via drill 0.35)
  Top 0.813: v120.65,15.24 v120.65,49.53
  Bottom 0.813: R25.2 118.11,15.24 | 118.11,15.24 Q6.1 | v120.65,49.53 120.65,52.07 JP6.1 | v120.65,15.24 118.11,15.24
DR1_IN
  Bottom 0.813: NUC.J1.9 JP9.9 JP6.2
DR2  (via drill 0.35)
  Top 0.813: v121.92,22.86 v121.92,49.53
  Bottom 0.813: Q7.1 118.11,24.13 R26.2 120.65,21.59 v121.92,22.86 | v121.92,49.53 121.92,53.34 JP6.3
DR2_IN
  Bottom 0.813: NUC.J1.10 JP9.10 JP6.4
E16.8V
  Bottom 0.813: R19.2 12.7,129.54 Q2.3 55.88,129.54 59.69,125.73 59.69,104.14 JP1.9
EA0
  Bottom 0.813: R1.1 110.49,114.3 R5.2 108.59,117.47 107.31,117.47 93.98,104.14 JP11.12 M2.J2.12
EA1
  Bottom 0.813: R2.1 113.03,114.3 R6.2 113.03,116.84 111.12,118.74 106.43,118.74 94.36,106.68 JP11.11 M2.J2.11
EA2
  Bottom 0.813: R3.1 115.57,114.3 R7.2 115.57,118.11 113.66,120.02 105.41,120.02 94.62,109.22 JP11.10 M2.J2.10
EA3
  Bottom 0.813: R4.1 118.11,114.3 R8.2 118.11,119.38 116.21,121.28 104.27,121.28 94.74,111.76 JP11.9 M2.J2.9
ED3
  Bottom 0.813: JP10.10 M2.J1.6 73.66,119.38 74.93,118.11 74.93,91.98 LED1.A
EN  (1 unrouted)
  Bottom 0.813: U$7.11 37.78,101.28 41.91,101.28 | J5.2 6.48,104.14 8.89,104.14 12.7,100.33 24.13,100.33 25.4,101.6 U$7.15 | OC_EN.4 50.8,85.09 R31.2 41.91,93.98 41.91,101.28 | 41.91,101.28 47.94,101.28 49.53,102.87 JP1.3
ENLED
  Bottom 0.813: R18.2 100.42,62.23 102.92,64.73 102.92,67.26 JP9.5 NUC.J1.5
GNDE  (1 unrouted)
  Bottom 0.813: R6.1 R5.1 R30.1 | R6.1 R7.1 R8.1 120.65,120.65 JP2.2 124.46,124.46 125.73,125.73 130.81,125.73 132.08,127 LED2.K 130.81,133.35 IC3.GND 116.84,133.35 | R6.1 113.03,127 JP24.3 JP5.3 JP4.3 JP3.3 93.98,130.81 JP11.2 M2.J2.2 | M2.J1.4 JP10.12 62.48,124.46 61.72,125.22 | 116.84,133.35 C8.2 | 116.84,133.35 C10.2 | 61.72,125.22 U$3.OUT- 61.72,114.81 63.5,113.03 63.5,99.06 | 61.72,125.22 61.72,126.49 49.78,138.43 10.16,138.43 6.35,134.62 6.35,127 10.16,123.19 OC_POW.4 13.97,121.92 15.24,120.65 17.78,120.65 21.59,124.46 57.15,124.46 58.42,123.19 58.42,120.65 57.15,119.38 24.13,119.38 22.1,117.35 U$3.IN- | R9.1 Q3.E 60.96,91.44 63.5,93.98 63.5,99.06 | 21.34,115.82 U$3.IN- | JP1.7 54.61,101.6 57.15,99.06 63.5,99.06 | U$3.IN- 22.1,110.36 U$7.19
GNDN  (11 unrouted)
  Bottom 0.813: R14.1 R15.1 R16.1 | R16.1 R17.1 | U$5.1 78.74,86.36 81.28,83.82 93.98,83.82 95.25,85.09 NUC.J2.2 JP8.2 95.25,96.52 97.79,99.06 JP17.2 R16.1 | NUC.J1.4 JP9.4 100.33,66.04 99.06,64.77 57.15,64.77 53.34,68.58 OC_EN.2 53.34,77.47 52.07,78.74 45.59,78.74 | JP2.1 130.81,120.65 134.62,116.84 134.62,93.98 | 110.49,36.83 R25.1 114.81,8.38 118.62,8.38 123.57,13.34 125.09,13.34 C5.2 128.27,11.43 | 110.49,36.83 Q5.3 110.49,45.72 111.76,46.99 JP20.4 | C4.2 128.27,11.43 | IC5.GND 128.27,11.43 | U$1.OUT- 103.63,17.34 100.33,20.64 100.33,34.29 | JP20.4 JP20.6 JP20.8 JP20.10 133.35,57.15 JP18.1 134.62,59.69 134.62,62.23 | JP20.4 JP20.2 | 100.33,34.29 102.87,36.83 110.49,36.83 | C6.2 96.52,11.43 | 96.52,11.43 C7.2 | 96.52,11.43 IC4.GND 96.52,5.08 95.25,3.81 88.9,3.81 | JP19.2 66.04,14.73 U$1.IN- 60.96,19.81 60.96,24.13 | JP19.2 JP19.10 | LED5.K 88.9,3.81 | JP19.2 64.77,10.16 63.5,8.89 63.5,6.35 66.04,3.81 | 66.04,3.81 88.9,3.81 | IC2.GND 55.88,5.08 57.15,3.81 66.04,3.81 | LED3.K 134.62,93.98 | 134.62,93.98 134.62,62.23 | JP25.1 134.62,62.23 | 56.9,24.13 60.96,24.13 | 60.96,24.13 60.96,25.4 66.42,30.86 66.42,35.56 64.35,37.63 62.7,37.63 60.96,39.37 JP26.1 60.96,43.18 | U$2.IN- 27.43,13.97 JP12.1 | 100.33,34.29 74.93,34.29 66.04,43.18 60.96,43.18 | 60.96,43.18 59.69,43.18 45.59,57.28 45.59,78.74 | 45.59,78.74 29.72,94.61 18.42,94.61 15.24,91.44 U$7.2 15.24,83.82 13.97,82.55 8.89,82.55 2.54,88.9 2.54,110.49 10.16,118.11 15.24,118.11 16.51,116.84 OC_POW.2
  Bottom 1.27: JP12.1 31.75,8.85 J1.- 36.41,4.19 42.29,4.19 44.02,5.92 J6.2 44.02,11 48.26,15.24 53.34,15.24 55.88,12.7 | C1.2 55.88,12.7 | 55.88,12.7 C9.2 | 55.88,12.7 IC2.GND
GR1_IN  (via drill 0.35)
  Top 0.813: v113.03,52.07 v105.41,52.07
  Bottom 0.813: NUC.J1.8 JP9.8 110.49,58.42 113.03,55.88 v113.03,52.07 | v105.41,52.07 J3.3
GR2_IN
  Bottom 0.813: NUC.J1.7 JP9.7 107.95,66.04 105.41,63.5 J3.4
MOTOR
  pour Top: 43.18,44.45 43.18,88.9 86.36,88.9 86.36,44.45
N6V
  Bottom 0.813: IC5.OUT 130.81,10.16 C4.1 132.08,13.97 D7.C D8.C JP15.2 JP16.2
N12V
  Bottom 0.813: JP20.9 JP20.7 JP20.5 JP20.3 JP20.1 D6.C D5.C JP14.2 JP13.2 133.35,28.03 135.72,25.66 135.72,6.35 133.18,3.81 127,3.81 125.73,5.08 IC5.IN 125.73,10.16 C5.1 119.38,6.35 113.03,6.35 107.95,11.43 107.95,13.97 | 107.95,13.97 107.95,33.02 106.93,34.04 U$1.OUT+ | 107.95,13.97 92.71,13.97 71.12,35.56 69.85,36.83 66.04,40.64 JP26.2
N$1
  Bottom 0.813: JP10.11 M2.J1.5
N$2
  Bottom 0.813: OC_EN.1 50.8,67.31 55.88,62.23 R18.1
N$4
  Bottom 0.813: NUC.J1.1 JP9.1
N$5
  Bottom 0.813: NUC.J1.2 JP9.2
N$6
  Bottom 0.813: NUC.J1.3 JP9.3
N$7
  Bottom 0.813: R9.2 LED1.K
N$8
  Bottom 0.813: R1.2 114.68,110.87 116.97,110.87 124.21,118.11 JP2.4
N$9
  Bottom 0.813: R2.2 115.7,109.35 117.47,109.35 123.7,115.57 JP2.6
N$10
  Bottom 0.813: R3.2 116.59,107.7 117.98,107.7 123.32,113.03 JP2.8
N$11
  Bottom 0.813: R4.2 118.11,105.41 123.19,110.49 JP2.10
N$12
  Bottom 0.813: NUC.J2.7 JP8.7 108,90.22 108,92.66 JP17.4 R34.2
N$13
  Bottom 0.813: JP17.3 107.28,96.52 109.14,94.65 109.14,91.52 JP8.8 NUC.J2.8 | 106.59,96.52 JP17.3 | R33.2 101.6,96.52 JP17.3
N$14
  Bottom 0.813: LED3.A 130.81,89.54 133.06,87.29 133.06,78.45 R21.2
N$15
  Bottom 0.813: R10.2 132.84,98.55 132.84,116.08 130.81,118.11 JP2.3
N$16
  Bottom 0.813: R11.2 131.06,99.31 131.06,114.05 129.54,115.57 JP2.5
N$17
  Bottom 0.813: R30.2 104.14,111.76 LED4.K
N$18
  Bottom 0.813: R12.2 126.49,100.84 126.49,109.98 JP2.9
N$19
  Bottom 0.813: R13.2 129.29,102.62 129.29,112.01 128.27,113.03 JP2.7
N$20
  Bottom 0.813: 33.02,46.99 JP22.12 U$6.10 33.02,58.42
N$21
  Bottom 0.813: Q2.1 12.7,134.62 R19.1 8.89,133.35 8.89,128.27 11.05,126.11 14.86,126.11 16.51,124.46 OC_POW.3
N$22
  Bottom 0.813: JP22.10 U$6.8
N$23
  Bottom 0.813: IC3.IN 116.84,135.89 C10.1 113.03,139.7 68.33,139.7 U$3.OUT+
N$24
  Bottom 0.813: JP22.3 U$6.2 10.16,77.47 12.7,80.01 17.78,80.01 20.32,82.55 U$7.4
N$25
  Bottom 0.813: U$3.IN+ 21.08,132.08 Q2.2
N$26
  Bottom 0.813: LED2.A 132.08,135.89 130.81,137.16 R20.1
N$27
  Bottom 0.813: NUC.J2.14 JP8.14 125.73,91.44 122.68,94.49 122.68,102.11 121.36,103.43 108.51,103.43 JP17.1 R34.1 R33.1
N$28
  Bottom 0.813: JP8.4 NUC.J2.4 100.33,85.09 102.87,82.55 109.22,82.55 D2.C 110.49,76.2 82.55,76.2 77.47,81.28 73.66,81.28 67.31,74.93 58.42,74.93 52.96,80.39 46.23,80.39 30.1,96.52 JP21.1
N$29
  Bottom 0.813: JP23.1 95.54,136.87 86.7,136.87 85.09,135.26 85.09,125.73 86.36,124.46 M2.J2.4 JP11.4 93.98,124.46 JP3.2 JP4.2 JP5.2 JP24.2
N$30
  Bottom 0.813: R12.1 R16.2 116.84,99.06 114.3,96.52 114.3,92.71 115.57,91.44 JP8.10 NUC.J2.10
N$31
  Bottom 0.813: Q3.B 49.53,93.98 R31.1
N$32
  Bottom 0.813: JP22.8 U$6.6
N$33
  Bottom 0.813: JP1.1 45.72,105.41 34.29,105.41 33.02,104.14 U$7.12
N$34
  Bottom 0.813: U$7.13 33.66,106.68 JP1.2
N$35
  Bottom 0.813: JP22.13 U$6.11 U$7.10
N$36  (1 unrouted)
  Bottom 1.27: J1.+ 39.37,15.24 | 39.37,15.24 36.83,17.78 R22.2 | Q1.3 58.42,17.78 59.69,16.51 C9.1 59.69,8.89 IC2.IN | 39.37,15.24 39.37,19.05
N$37
  Bottom 1.27: IC2.OUT 52.07,8.89 | 52.07,8.89 C1.1 | J6.1 52.07,8.89
N$38
  Bottom 0.813: JP22.2 U$6.1
N$39
  Bottom 0.813: U$7.14 27.94,106.05 31.11,109.22 46.99,109.22 JP1.4
N$40
  Bottom 0.813: U$7.16 29.84,110.49 48.26,110.49 JP1.6
N$41
  Bottom 0.813: U$7.17 28.58,111.76 49.53,111.76 JP1.8
N$42
  Bottom 0.813: JP11.1 M2.J2.1
N$43
  Bottom 0.813: U$7.18 27.31,113.03 50.8,113.03 JP1.10
N$45
  Bottom 0.813: NUC.J1.13 JP9.13 123.19,63.5 128.27,58.42 JP18.2
N$46
  Bottom 0.813: NUC.J1.14 JP9.14 125.73,64.77 128.27,62.23 JP25.2
N$47
  Bottom 0.813: JP8.13 NUC.J2.13
N$48
  Bottom 0.813: NUC.J1.15 JP9.15
N$49
  Bottom 0.813: JP22.11 U$6.9 30.48,67.31 34.29,71.12 34.29,81.28 33.02,82.55 U$7.9
N$50
  Bottom 0.813: JP7.3 77.47,38.1 78.74,36.83 96.52,36.83 110.49,50.8 110.49,55.88 109.22,57.15 J3.6
N$51
  Bottom 0.813: JP7.1 72.39,52.07 77.47,57.15 J3.2
N$52
  Bottom 0.813: 74.93,41.91 JP7.2 74.93,50.8 78.74,54.61 J3.1
N$53
  Bottom 0.813: J3.5 107.95,52.07 96.52,40.64 JP7.4
N$54
  Bottom 0.813: JP8.1 NUC.J2.1
N$55
  Bottom 0.813: R13.1 R17.2 116.84,101.6 113.03,97.79 JP8.9 NUC.J2.9
N$56
  Bottom 0.813: JP8.3 NUC.J2.3
N$57
  Bottom 0.813: JP21.2 12.7,87.63 U$7.1
N$60
  Bottom 0.813: JP22.4 U$6.3
N$61
  Bottom 0.813: JP22.9 U$6.7 25.4,66.04 33.02,73.66 33.02,80.01 30.48,82.55 U$7.8
N$64
  Bottom 0.813: JP8.15 NUC.J2.15 128.27,83.82 R21.1
N$66
  Bottom 0.813: JP22.6 U$6.5
N$67
  Bottom 0.813: JP22.7 U$6.+5V(OUT)
N$68
  Bottom 0.813: JP22.5 U$6.4 15.24,68.58 20.32,73.66 30.48,73.66 31.75,74.93 31.75,78.74 29.21,81.28 22.86,81.28 U$7.5
N$70
  Bottom 1.27: R27.2 R22.1 Q1.1
N$73
  Bottom 0.813: 5.08,47.62 JP22.1 U$6.0 5.08,74.93 11.43,81.28 16.51,81.28 17.78,82.55 U$7.3
N$75
  Bottom 0.813: M2.J1.15 JP10.1
N$76
  Bottom 0.813: JP10.2 M2.J1.14
N$77
  Bottom 0.813: M2.J1.13 JP10.3
N$78
  Bottom 0.813: JP10.4 M2.J1.12
N$79
  Bottom 0.813: M2.J1.11 JP10.5
N$80
  Bottom 0.813: JP10.6 M2.J1.10
N$81
  Bottom 0.813: JP10.7 M2.J1.9
N$82
  Bottom 0.813: M2.J1.8 JP10.8
N$83
  Bottom 0.813: JP10.9 M2.J1.7
N$84
  Bottom 0.813: JP22.14 U$6.VSRV
N$86
  Bottom 0.813: M2.J1.3 JP10.13
N$87
  Bottom 0.813: JP10.14 M2.J1.2
N$88
  Bottom 0.813: M2.J1.1 JP10.15
N$89
  Bottom 0.813: M2.J2.15 JP11.15 93.31,96.52 96.52,99.73 96.52,102.87 97.79,104.14 102.87,104.14 LED4.A
N$90
  Bottom 0.813: JP11.14 M2.J2.14
N$91
  Bottom 0.813: JP11.13 M2.J2.13
N$93
  Bottom 0.813: JP11.3 M2.J2.3
N$95
  Bottom 0.813: D5.A 127,38.1 128.27,36.83 128.27,31.75 JP13.1 129.54,27.94 118.11,27.94 113.03,33.02 Q4.2
N$96
  Bottom 0.813: 130.81,34.29 JP14.1 130.81,39.37 129.54,40.64 D6.A 121.92,36.83 118.11,36.83 113.03,41.91 Q5.2
N$97
  Bottom 1.27: JP12.2 34.29,16.51 R27.1
N$98
  Bottom 0.813: JP15.1 130.81,16.51 129.54,15.24 D7.A 123.19,15.24 118.11,10.16 115.57,10.16 113.03,12.7 Q6.2
N$99
  Bottom 0.813: JP16.1 128.27,22.86 128.27,19.05 127,17.78 D8.A 119.38,17.78 113.03,24.13 Q7.2
N$100
  Bottom 0.813: C7.1 100.33,7.62 IC4.IN 99.06,3.96 96.52,1.42 31.6,1.42 13.97,19.05 13.97,44.45 53.85,44.45 U$2.OUT+
N$101
  Bottom 0.813: R28.1 21.59,121.92 19.05,119.38 19.05,113.03 17.78,111.76 15.24,111.76 13.97,113.03 OC_POW.1
N$102
  Bottom 0.813: Q1.2 52.07,20.32 46.99,25.4 46.99,34.04 | U$2.IN+ 24.64,34.04 46.99,34.04 | 46.99,34.04 U$1.IN+
N$104
  Bottom 0.813: LED5.A 83.82,8.89 R29.1
N$106
  Bottom 0.813: LED6.K Q3.C
N$107
  Bottom 0.813: LED6.A 49.53,99.06 R32.2
NA0
  Bottom 0.813: JP8.5 NUC.J2.5
NA1
  Bottom 0.813: JP8.6 NUC.J2.6
NA2
  Bottom 0.813: R11.1 R15.2 116.84,96.52 115.57,95.25 115.57,93.98 118.11,91.44 JP8.11 NUC.J2.11
NA3
  Bottom 0.813: R14.2 R10.1 JP8.12 NUC.J2.12
NTSOP
  Bottom 0.813: U$5.3 81.28,73.66 104.14,73.66 105.37,72.43 | 105.37,72.43 105.41,72.43 | JP9.6 NUC.J1.6 105.37,71.16 105.37,72.43
TMP1
  Bottom 0.813: JP24.1 107.95,125.73 105.41,123.19 103.5,123.19 94.62,114.3 JP11.8 M2.J2.8
TMP2
  Bottom 0.813: JP5.1 104.14,125.73 101.6,123.19 100.33,123.19 93.98,116.84 JP11.7 M2.J2.7
TMP3
  Bottom 0.813: JP4.1 100.33,125.73 93.98,119.38 JP11.6 M2.J2.6
TMP4
  Bottom 0.813: JP3.1 93.98,121.92 JP11.5 M2.J2.5
TP1  (via drill 0.35)
  Top 0.813: v123.19,31.75 v123.19,49.53
  Bottom 0.813: 115.57,34.29 Q4.1 118.11,33.02 R23.2 121.92,30.48 v123.19,31.75 | v123.19,49.53 123.19,54.61 JP6.5
TP1_IN
  Bottom 0.813: NUC.J1.11 JP9.11 JP6.6
TP2  (via drill 0.35)
  Top 0.813: v124.46,43.18 v124.46,49.53
  Bottom 0.813: R24.2 118.11,41.91 | 118.11,41.91 Q5.1 115.57,43.18 | 118.11,41.91 123.19,41.91 v124.46,43.18 | JP6.7 124.46,55.88 v124.46,49.53
TP2_IN
  Bottom 0.813: NUC.J1.12 JP9.12 JP6.8
VCCE  (via drill 0.35)
  Top 0.813: v77.47,88.9 v55.88,88.9
  Bottom 0.813: R20.2 125.73,130.81 IC3.OUT 116.84,130.81 C8.1 114.3,129.54 109.22,134.62 JP23.2 99.11,135.84 99.11,135.93 96.74,138.3 86.23,138.3 83.86,135.93 83.86,131.54 77.47,125.14 v77.47,88.9 | U$7.20 8.25,107.95 5.08,107.95 3.81,106.68 3.81,102.87 5.08,101.6 6.22,101.6 J5.1 9.4,98.42 30.61,98.42 46.99,82.04 51.56,82.04 OC_EN.3 53.34,86.36 | R32.1 48.26,91.44 53.34,86.36 | 53.34,86.36 v55.88,88.9
VCCN  (via drill 0.35)
  Top 0.813: v86.36,16.51 v86.36,78.74
  Bottom 0.813: IC4.OUT 92.71,7.62 C6.1 90.17,13.97 86.36,13.97 | 86.36,13.97 R29.2 81.28,10.16 78.74,7.62 JP19.9 JP19.7 JP19.5 JP19.3 JP19.1 | 86.36,80.01 81.28,80.01 77.47,83.82 U$5.2 72.39,83.82 68.58,80.01 66.04,80.01 64.77,81.28 64.77,120.65 R28.2 | 86.36,80.01 96.52,80.01 D2.A | 86.36,13.97 v86.36,16.51 | v86.36,78.74 86.36,80.01
(copper drawn outside any net)
  shapes: Top area x8